# EAGLE design ROBOT (EAGLE 6.3)
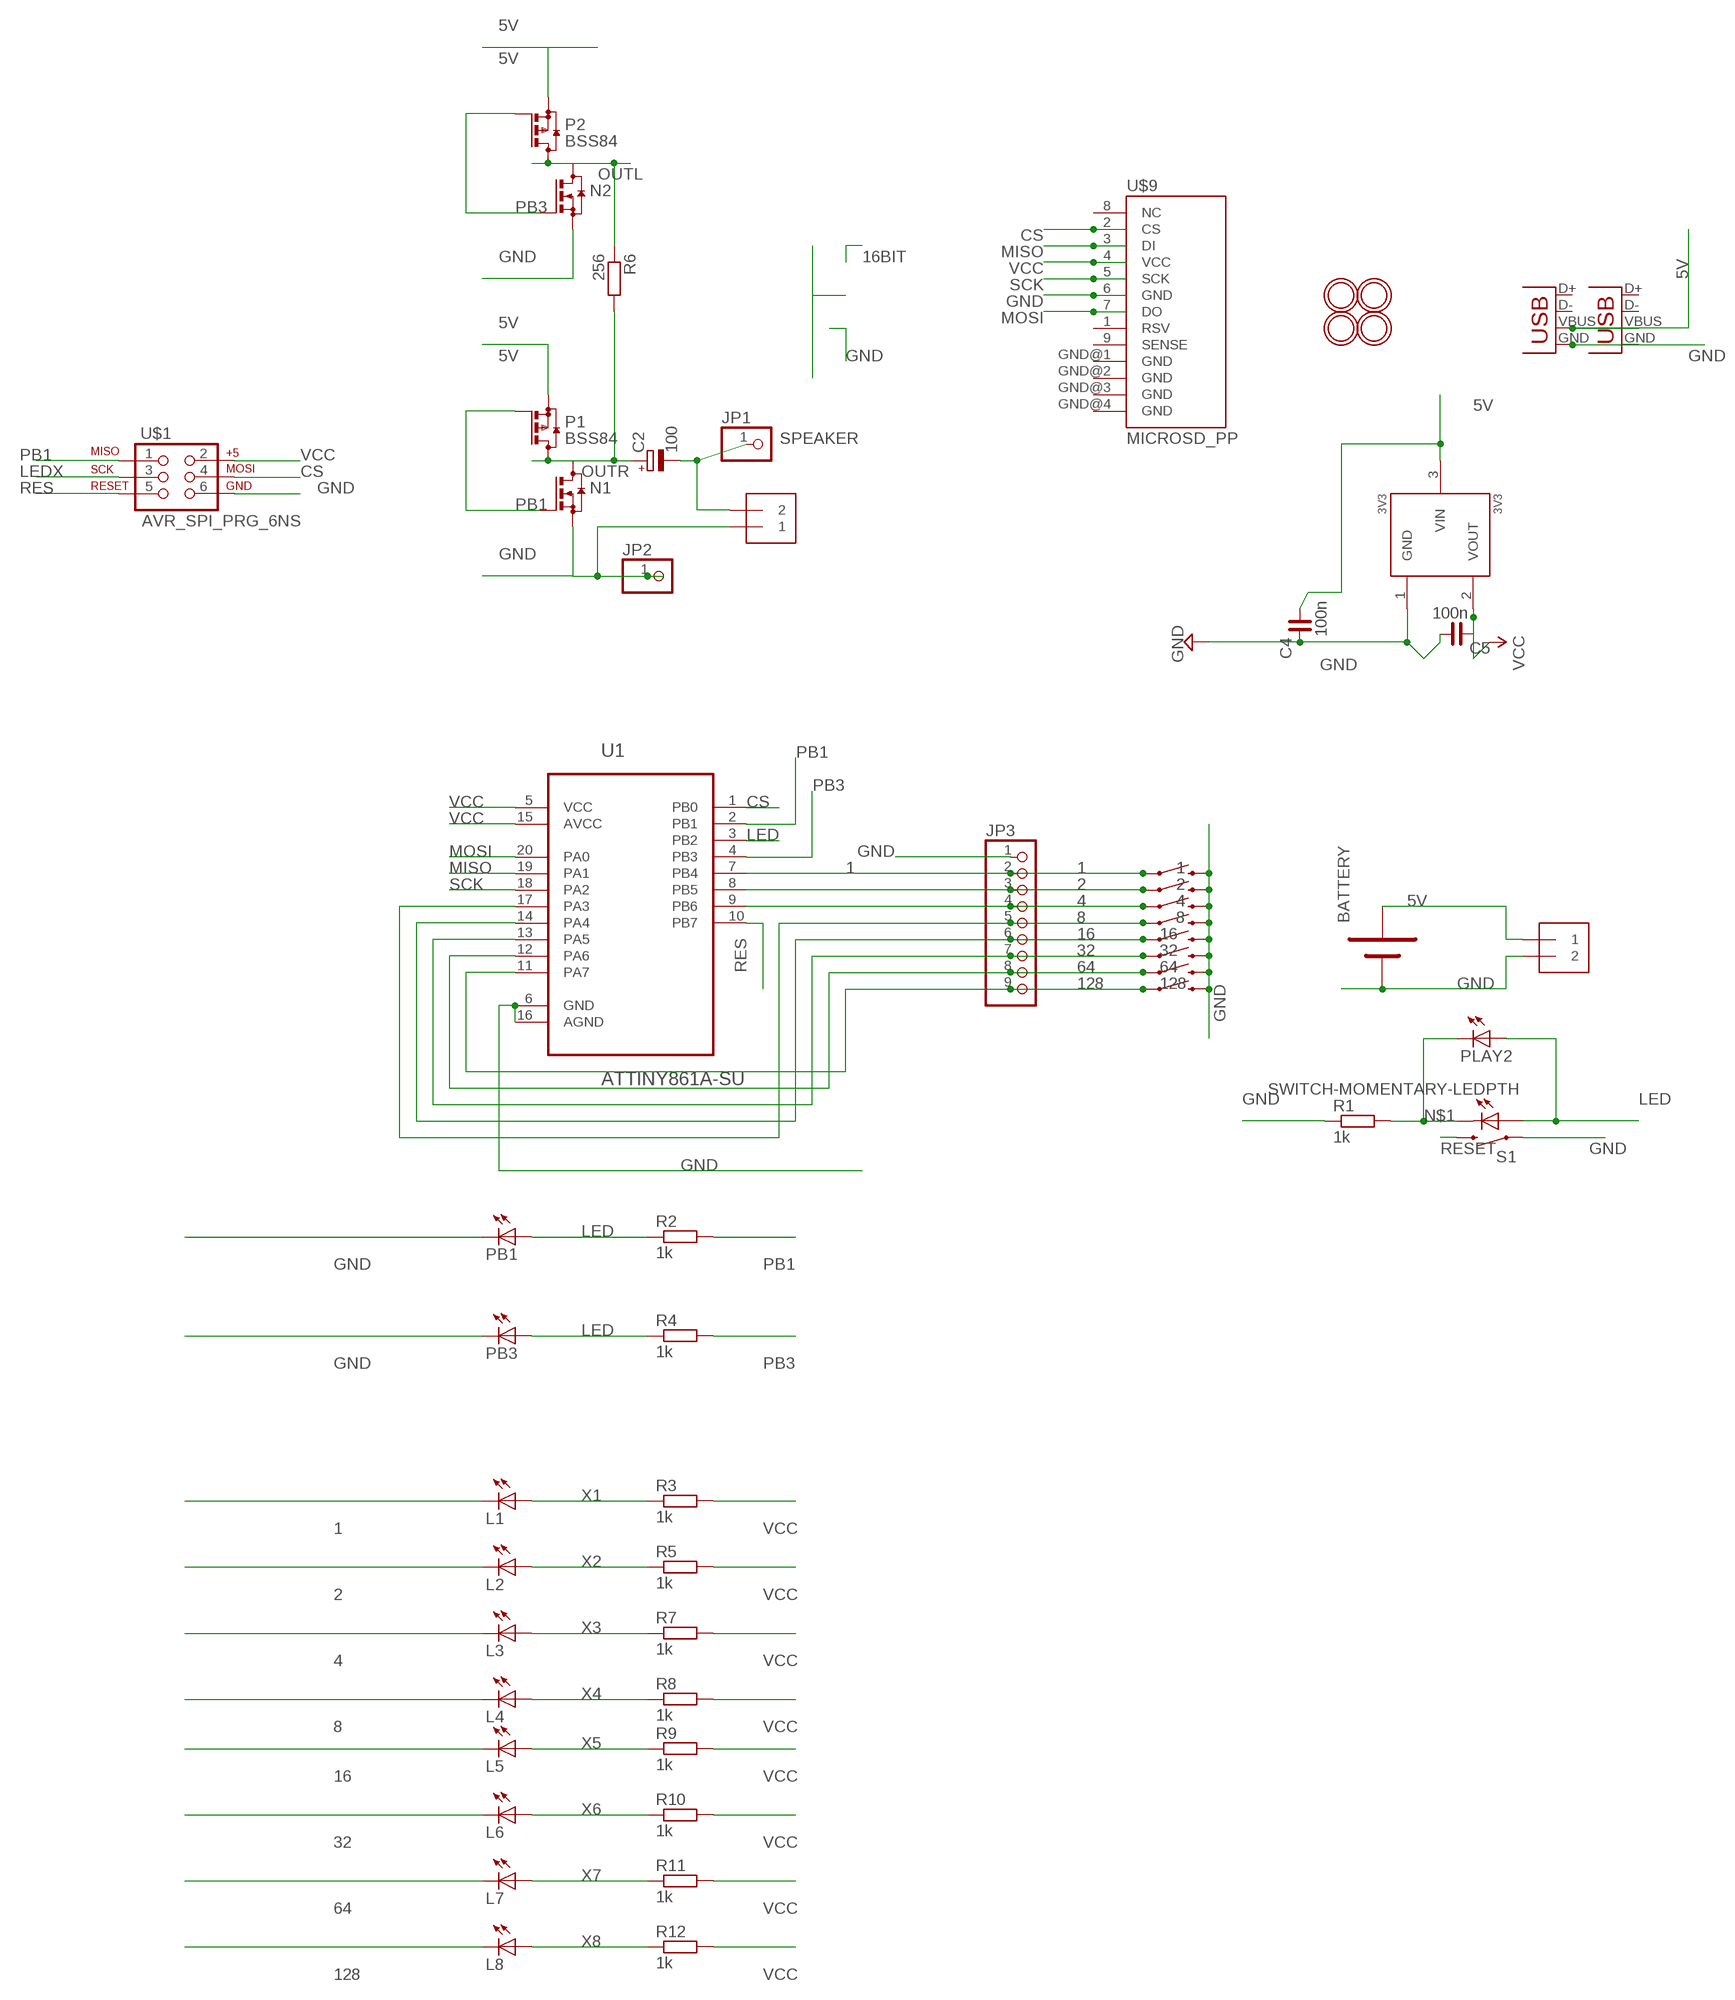
[diagram p0: schematic, sheet 1]

## Parts
1  SWITCH-MOMENTARY-2-SMD-1101NE  [TACTILE-SWITCH-1101NE]
2  SWITCH-MOMENTARY-2-SMD-1101NE  [TACTILE-SWITCH-1101NE]
3V3  3V3  MCP1700T  [SOT23]
4  SWITCH-MOMENTARY-2-SMD-1101NE  [TACTILE-SWITCH-1101NE]
8  SWITCH-MOMENTARY-2-SMD-1101NE  [TACTILE-SWITCH-1101NE]
16  SWITCH-MOMENTARY-2-SMD-1101NE  [TACTILE-SWITCH-1101NE]
32  SWITCH-MOMENTARY-2-SMD-1101NE  [TACTILE-SWITCH-1101NE]
64  SWITCH-MOMENTARY-2-SMD-1101NE  [TACTILE-SWITCH-1101NE]
128  SWITCH-MOMENTARY-2-SMD-1101NE  [TACTILE-SWITCH-1101NE]
BATTERY  BATTERY-1XAA20MM  [BATTCOM_20MM_PTH]
C2  100  CPOL-EU153CLV-0605  [153CLV-0605]
C4  100n  C_0603  [C0603]
C5  100n  C_0603  [C0603]
J1  1X2-3.5MM  [1X2-3.5MM]
J2  1X2-3.5MM  [1X2-3.5MM]
JP1  PINHD-1X1  [1X01]
JP2  PINHD-1X1  [1X01]
JP3  PINHD-1X9  [1X09]
L1  LEDSML0603  [SML0603]
L2  LEDSML0603  [SML0603]
L3  LEDSML0603  [SML0603]
L4  LEDSML0603  [SML0603]
L5  LEDSML0603  [SML0603]
L6  LEDSML0603  [SML0603]
L7  LEDSML0603  [SML0603]
L8  LEDSML0603  [SML0603]
N1  BSS123  [SOT23]
N2  BSS123  [SOT23]
P1  BSS84  [SOT23]
P2  BSS84  [SOT23]
PB1  LEDSML0603  [SML0603]
PB3  LEDSML0603  [SML0603]
PLAY2  LEDSML0603  [SML0603]
R1  1k  R-EU_R0603  [R0603]
R2  1k  R-EU_R0603  [R0603]
R3  1k  R-EU_R0603  [R0603]
R4  1k  R-EU_R0603  [R0603]
R5  1k  R-EU_R0603  [R0603]
R6  256  R-EU_R0603  [R0603]
R7  1k  R-EU_R0603  [R0603]
R8  1k  R-EU_R0603  [R0603]
R9  1k  R-EU_R0603  [R0603]
R10  1k  R-EU_R0603  [R0603]
R11  1k  R-EU_R0603  [R0603]
R12  1k  R-EU_R0603  [R0603]
S1  SWITCH-MOMENTARY-LEDPTH  [TACTILE-PTH-LED-12MM]
U1  ATTINY861A-SU  [SOIC127P1032X265-20N]
U$1  AVR_SPI_PRG_6NS  [2X3-NS]
U$3  MOUNTINGHOLE1.0  [MOUNTINGHOLE_1.0_PLATED]
U$4  MOUNTINGHOLE1.0  [MOUNTINGHOLE_1.0_PLATED]
U$6  MOUNTINGHOLE3.0THIN  [MOUNTINGHOLE_3.0_PLATEDTHIN]
U$7  MOUNTINGHOLE3.0THIN  [MOUNTINGHOLE_3.0_PLATEDTHIN]
U$9  MICROSD_PP  [MICROSD_PP]
X1  USB-MICROB  [USB-MICROB]
X5  USBSMD  [USB-MINIB]

## Nets
1: 1.P$1 JP3.2 L1.C U1.7(PB4)
2: 2.P$1 JP3.3 L2.C U1.8(PB5)
4: 4.P$1 JP3.4 L3.C U1.9(PB6)
5V [GND]: 3V3.3(VIN) BATTERY.+ C4.1 J2.1 P1.2(S) P2.2(S) X1.VBUS X5.VBUS
8: 8.P$1 JP3.5 L4.C U1.17(PA3)
16: 16.P$1 JP3.6 L5.C U1.14(PA4)
32: 32.P$1 JP3.7 L6.C U1.13(PA5)
64: 64.P$1 JP3.8 L7.C U1.12(PA6)
128: 128.P$1 JP3.9 L8.C U1.11(PA7)
CS: U1.1(PB0) U$1.4 U$9.2(CS)
GND: 1.P$2 2.P$2 3V3.1(GND) 4.P$2 8.P$2 16.P$2 32.P$2 64.P$2 128.P$2 BATTERY.- C4.2 C5.1 J1.1 J2.2 JP2.1 JP3.1 N1.2(S) N2.2(S) PB1.C PB3.C R1.1 S1.4 U1.6(GND) U1.16(AGND) U$1.6 U$9.6(GND) X1.GND X5.GND
LED: PB1.A PB3.A PLAY2.A R2.1 R4.1 S1.A U1.3(PB2)
LEDX: U$1.3
MISO: U1.19(PA1) U$9.3(DI)
MOSI: U1.20(PA0) U$9.7(DO)
N$1: PLAY2.C R1.2 S1.C
OUTL: N2.3(D) P2.3(D) R6.1
OUTR: C2.+ N1.3(D) P1.3(D) R6.2
PB1: N1.1(G) P1.1(G) R2.2 U1.2(PB1) U$1.1
PB3: N2.1(G) P2.1(G) R4.2 U1.4(PB3)
RES: U1.10(PB7) U$1.5
RESET: S1.2
SCK: U1.18(PA2) U$9.5(SCK)
SPEAKER: C2.- J1.2 JP1.1
VCC: 3V3.2(VOUT) C5.2 R3.2 R5.2 R7.2 R8.2 R9.2 R10.2 R11.2 R12.2 U1.5(VCC) U1.15(AVCC) U$1.2 U$9.4(VCC)
X1: L1.A R3.1
X2: L2.A R5.1
X3: L3.A R7.1
X4: L4.A R8.1
X5: L5.A R9.1
X6: L6.A R10.1
X7: L7.A R11.1
X8: L8.A R12.1
Unconnected: U$9.1(RSV) U$9.8(NC) U$9.9(SENSE) U$9.GND@1(GND) U$9.GND@2(GND) U$9.GND@3(GND) U$9.GND@4(GND) X1.D+ X1.D- X5.D+ X5.D-

## Library data of the parts
1 2 4 8 16 32 64 128 = SparkFun:SWITCH-MOMENTARY-2
3V3 = okie:MCP1700T
BATTERY = es:BATTERY-1XAA
C2 = resistor:CPOL-EU: POLARIZED CAPACITOR, European symbol
C4 C5 = rc-master-smd:C_: NON-POLARIZED CAP
J1 J2 = adafruit:1X2: 3.5mm Terminal block http://www.ladyada.net/library/pcb/eaglelibrary.html
JP1 JP2 = pinhead:PINHD-1X1: PIN HEADER
JP3 = pinhead:PINHD-1X9: PIN HEADER
L1-L8 PB1 PB3 PLAY2 = led:LED: LED OSRAM: - CHIPLED LG R971, LG N971, LY N971, LG Q971, LY Q971, LO R971, LY R971 LH N974, LH R974 LS Q976, LO Q976, LY Q976 LO Q996 - Hyper CHIPLED LW Q18S LB Q993, LB Q99A, LB R99A - SideLED LS A670, LO A670, LY A670, LG A670, LP A670 LB A673, LV A673, LT A673, LW A673 LH A674 LY A675 LS A676, LA A676, LO A676, LY A676, LW A676 LS A679, LY A679, LG A679 - Hyper Micro SIDELED® LS Y876, LA Y876, LO Y876, LY Y876 LT Y87S - SmartLED LW L88C, LW L88S LB L89C, LB L89S, LG L890 LS L89K, LO L89K, LY L89K LS L896, LA L896, LO L896, LY L896 - TOPLED LS T670, LO T670, LY T670, LG T670, LP T670 LSG T670, LSP T670, LSY T670, LOP T670, LYG T670 LG T671, LOG T671, LSG T671 LB T673, LV T673, LT T673, LW T673 LH T674 LS T676, LA T676, LO T676, LY T676, LB T676, LH T676, LSB T676, LW T676 LB T67C, LV T67C, LT T67C, LS T67K, LO T67K, LY T67K, LW E67C LS E67B, LA E67B, LO E67B, LY E67B, LB E67C, LV E67C, LT E67C LW T67C LS T679, LY T679, LG T679 LS T770, LO T770, LY T770, LG T770, LP T770 LB T773, LV T773, LT T773, LW T773 LH T774 LS E675, LA E675, LY E675, LS T675 LS T776, LA T776, LO T776, LY T776, LB T776 LHGB T686 LT T68C, LB T68C - Hyper Mini TOPLED® LB M676 - Mini TOPLED Santana® LG M470 LS M47K, LO M47K, LY M47K Source: http://www.osram.convergy.de LUXEON: - LUMILED® LXK2-PW12-R00, LXK2-PW12-S00, LXK2-PW14-U00, LXK2-PW14-V00 LXK2-PM12-R00, LXK2-PM12-S00, LXK2-PM14-U00 LXK2-PE12-Q00, LXK2-PE12-R00, LXK2-PE12-S00, LXK2-PE14-T00, LXK2-PE14-U00 LXK2-PB12-K00, LXK2-PB12-L00, LXK2-PB12-M00, LXK2-PB14-N00, LXK2-PB14-P00, LXK2-PB14-Q00 LXK2-PR12-L00, LXK2-PR12-M00, LXK2-PR14-Q00, LXK2-PR14-R00 LXK2-PD12-Q00, LXK2-PD12-R00, LXK2-PD12-S00 LXK2-PH12-R00, LXK2-PH12-S00 LXK2-PL12-P00, LXK2-PL12-Q00, LXK2-PL12-R00 Source: www.luxeon.com KINGBRIGHT: KA-3528ASYC Source: www.kingbright.com
N1 N2 = transistor-small-signal:BSS123: N-CHANNEL MOS FET
P1 P2 = transistor-small-signal:BSS84: P-CHANNEL MOS FET
R1-R12 = resistor:R-EU_: RESISTOR, European symbol
S1 = Local Library:SWITCH-MOMENTARY-LED
U1 = Atmel_By_element14_Batch_1-00:ATTINY861A-SU: 8-bit Microcontroller with In-System Programmable Flash; MPN: ATTINY861A-SU; OC_FARNELL: 1841628; OC_NEWARK: 12T1344; PACKAGE: SOIC-20; SUPPLIER: Atmel
U$1 = SparkFun:AVR_SPI_PRG_6: AVR ISP 6 Pin This is the reduced ISP connector for AVR programming. Common on Arduino. This footprint will take up less PCB space and can be used with a 10-pin to 6-pin adapter such as SKU: BOB-08508
U$3 U$4 U$6 U$7 = microbuilder:MOUNTINGHOLE: Mounting Hole
U$9 = DE1594-v2:MICROSD_PP
X1 X5 = SparkFun:USB: USB Connectors USB-B-PTH is fully proven SKU : PRT-00139 USB-miniB is fully proven SKU : PRT-00587 USB-A-PCB is untested. USB-A-H is throughly reviewed, but untested. Spark Fun Electronics SKU : PRT-00437 USB-B-SMT is throughly reviewed, but untested. Needs silkscreen touching up. USB-A-S has not been used/tested USB-MB-H has not been used/tested

## Net classes
0 default: width 0.279 mm, drill 0.381 mm, clearance 0.279 mm
1 GND: width 0.279 mm, drill 0.381 mm, clearance 0.279 mm
2 pwr: width 0.279 mm, drill 0.381 mm, clearance 0.279 mm

## Board
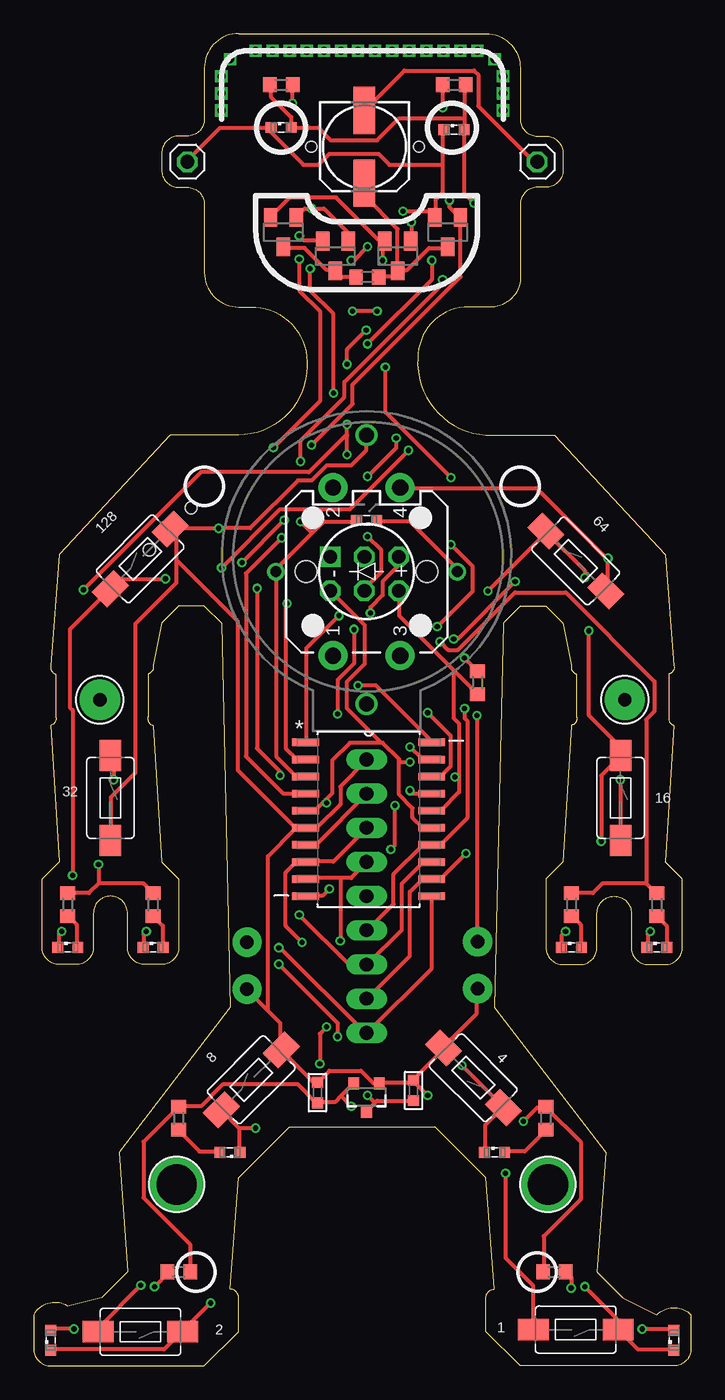
[diagram p1: board, top side]
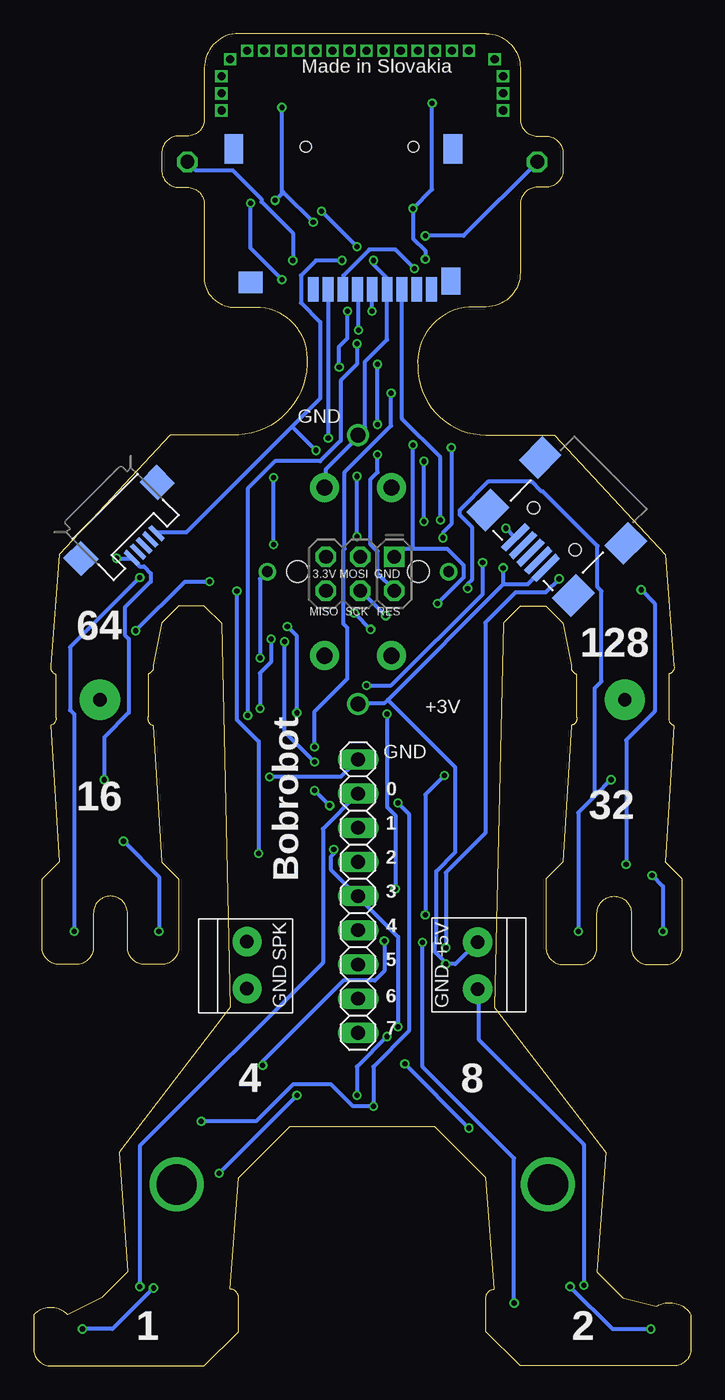
[diagram p2: board, bottom side, seen from below]

Size 48.89 x 99.06 mm. Coordinates in mm from the lower left corner, seen from the top.
Outline: 33.66,99.06 arc-90 36.2,96.52 36.2,92.71 arc90 37.46,91.44 38.1,91.44 arc-90 39.37,90.17 39.37,88.9 arc-90 38.1,87.63 37.46,87.63 arc90 36.2,86.36 36.2,81.28 arc-90 34.29,78.74 32.38,78.74 arc90 28.58,74.93 arc90 33.66,69.22 38.73,69.22 46.99,60.33 47.62,52.07 arc-90 47.24,51.44 47.24,48.26 arc90 47.62,47.62 46.99,37.47 48.26,36.2 48.26,31.11 arc-90 46.99,29.84 45.72,29.84 arc-90 44.45,31.11 44.45,33.66 arc90 43.18,34.92 arc90 41.91,33.66 41.91,31.11 arc-90 40.64,29.84 39.37,29.84 arc-90 38.1,31.11 38.1,36.2 39.37,37.47 40.01,47.62 arc90 40.39,48.26 40.39,51.44 arc-90 40.01,52.07 39.37,55.25 38.1,56.52 36.2,56.52 34.92,55.25 34.29,26.67 42.55,15.88 41.91,6.99 43.81,5.08 46.35,3.81 arc-90 48.89,3.81 48.89,1.27 arc-90 47.62,0 36.2,0 33.66,2.54 33.66,5.08 arc-90 34.29,5.71 33.66,13.97 29.84,17.78 19.05,17.78 15.24,13.97 14.61,5.71 arc-90 15.24,5.08 15.24,2.54 12.7,0 1.27,0 arc-90 0,1.27 0,3.81 arc-90 2.54,4.45 5.08,5.08 6.98,6.99 6.35,15.88 14.61,26.67 13.97,55.25 12.7,56.52 10.79,56.52 9.52,55.25 8.89,52.07 arc-90 8.51,51.44 8.51,48.26 arc90 8.89,47.62 9.52,37.47 10.79,36.2 10.79,31.11 arc-90 9.52,29.84 8.25,29.84 arc-90 6.98,31.11 6.98,33.66 arc90 5.71,34.92 arc90 4.45,33.66 4.45,31.11 arc-90 3.17,29.84 1.9,29.84 arc-90 0.63,31.11 0.63,36.2 1.9,37.47 1.27,47.62 arc90 1.65,48.26 1.65,51.44 arc-90 1.27,52.07 1.9,60.33 10.16,69.22 15.24,69.22 arc90 20.32,74.3 arc90 16.51,78.74 15.24,78.74 arc-90 12.7,81.28 12.7,86.36 arc90 11.43,87.63 10.79,87.63 arc-90 9.52,88.9 9.52,90.17 arc-90 10.79,91.44 11.43,91.44 arc90 12.7,92.71 12.7,96.52 arc-90 15.24,99.06 33.66,99.06
Copper layers (1*16): Top 0.035mm / dielectric 1.5mm / Bottom 0.035mm
Design rules "ITEADstudio_DRC *": minimum track width 6mil, minimum drill 12mil, track to track 6mil, track to pad 6mil, pad to pad 6mil, via to via 6mil, smd to smd 0mil, copper to edge 30mil, drill to drill 10mil, minimum pad ring 10mil, minimum via ring 6mil, stop-mask expansion 2mil, vias tented up to drill 100mil, thermal gap 10mil

### Footprints (pad centres in the part's own frame; a part is rotated, then mirrored left to right if it is on the bottom)
TACTILE-SWITCH-1101NE = smd 2.3 x 1.6: P$1 -3.15,0; P$2 3.15,0
SOT23 = smd 0.8 x 0.9: 1 -0.95,-1; 2 0.95,-1; 3 0,1.1
BATTCOM_20MM_PTH = drill 1.1: + 20,0; - 0,0
153CLV-0605 = smd 3.5 x 1.6: + 2.7,0; - -2.7,0
C0603 = smd 0.8 x 0.8: 1 -0.762,0; 2 0.762,0
1X2-3.5MM = drill 1 pad 2.184: 1 1.8,0; 2 -1.7,0
1X01 = drill 1.016 octagon: 1 0,0
1X09 = drill 1.016 long: 1 -10.16,0; 2 -7.62,0; 3 -5.08,0; 4 -2.54,0; 5 0,0; 6 2.54,0; 7 5.08,0; 8 7.62,0; 9 10.16,0
SML0603 = smd 0.8 x 0.8: A 0.75,0; C -0.75,0
SOT23' = smd 1 x 1.4: 1 -0.95,-1.1; 2 0.95,-1.1; 3 0,1.1
R0603 = smd 1 x 1.1: 1 -0.85,0; 2 0.85,0
TACTILE-PTH-LED-12MM = drill 1.2 pad 2.159: 1 -6.25,2.5; 2 6.25,2.5; 3 -6.25,-2.5; 4 6.25,-2.5 | drill 0.8: A 0,6.75; C 0,-6.75 | hole 1.6: 0,4.5; 0,-4.5
SOIC127P1032X265-20N = smd 1.981 x 0.559: 1 -4.699,5.715; 2 -4.699,4.445; 3 -4.699,3.175; 4 -4.699,1.905; 5 -4.699,0.635; 6 -4.699,-0.635; 7 -4.699,-1.905; 8 -4.699,-3.175; 9 -4.699,-4.445; 10 -4.699,-5.715; 11 4.699,-5.715; 12 4.699,-4.445; 13 4.699,-3.175; 14 4.699,-1.905; 15 4.699,-0.635; 16 4.699,0.635; 17 4.699,1.905; 18 4.699,3.175; 19 4.699,4.445; 20 4.699,5.715
2X3-NS = drill 1.016 square: 1 -2.54,-1.27 | drill 1.016 octagon: 2 -2.54,1.27; 3 0,-1.27; 4 0,1.27; 5 2.54,-1.27; 6 2.54,1.27
MOUNTINGHOLE_1.0_PLATED = drill 1 pad 3: P$1 0,0
MOUNTINGHOLE_3.0_PLATEDTHIN = drill 3 pad 3.6: P$1 0,0
MICROSD_PP = smd 1.8 x 0.8: 1 0,3.85; 2 0,2.75; 3 0,1.65; 4 0,0.55; 5 0,-0.55; 6 0,-1.65; 7 0,-2.75; 8 0,-3.85; 9 0,-4.95 | smd 1.6 x 1.8: GND@1 0.5,8.5 | smd 2.2 x 1.4: GND@2 10.45,9.75; GND@4 10.45,-6.55 | smd 2 x 1.4: GND@3 0.6,-6.4 | hole 0.8: 10.6,4.4; 10.6,-3.6
USB-MICROB = smd 0.35 x 1.4: D+ 0,2.65; D- -0.65,2.65; GND 1.3,2.65; ID 0.65,2.65; VBUS -1.3,2.65 | smd 1.8 x 1.9: MT1 -4,0; MT2 4,0
USB-MINIB = smd 2.5 x 0.5: D+ 2.5,0; D- 2.5,0.8; GND 2.5,-1.6; ID 2.5,-0.8; VBUS 2.5,1.6 | smd 2.5 x 2: MTN1 -3,4.5; MTN2 2.5,4.5; MTN3 -3,-4.5; MTN4 2.5,-4.5 | hole 0.9: 0,2.2; 0,-2.2

### Placement (x,y rotation side)
1  40.32,2.7 180 top
2  7.94,2.54 180 top
3V3  24.77,20 180 top
4  32.7,21.43 135 top
8  16.19,21.27 45 top
16  43.66,42.23 270 top
32  5.71,42.23 270 top
64  40.32,59.85 315 top
128  7.94,60.01 45 top
BATTERY  24.77,69.22 270 top
C2  24.61,90.65 270 top
C4  28.26,20.48 90 top
C5  21.11,20.32 270 top
J1  33.02,29.84 270 bottom
J2  15.88,29.72 90 bottom
JP1  37.46,89.53 0 top
JP2  11.43,89.53 0 top
JP3  24.77,34.92 270 bottom
L1  47.62,1.9 90 top
L2  1.27,1.9 90 top
L3  34.29,15.88 0 top
L4  14.61,15.88 180 top
L5  40.01,31.11 0 top
L6  8.89,31.11 0 top
L7  46.35,31.11 0 top
L8  2.54,31.11 0 top
N1  BSS123  [SOT23']  30.8,84.3 180 top
N2  BSS123  [SOT23']  22.45,82.52 180 top
P1  BSS84  [SOT23']  27.08,82.52 180 top
P2  BSS84  [SOT23']  18.57,84.3 180 top
PB1  31.27,91.92 0 top
PB3  18.41,92.08 0 top
PLAY2  24.77,62.86 180 top
R1  33.02,50.8 90 top
R2  31.27,95.25 180 top
R3  38.73,6.99 180 top
R4  18.41,95.25 0 top
R5  10.79,6.99 0 top
R6  24.83,80.96 0 top
R7  38.1,18.41 90 top
R8  10.79,18.41 90 top
R9  40.01,34.29 90 top
R10  8.89,34.29 90 top
R11  46.35,34.29 90 top
R12  2.54,34.29 90 top
S1  24.77,59.06 90 top
U1  24.92,40.64 0 top
U$1  24.61,58.9 180 bottom
U$3  43.97,49.53 0 top
U$4  4.92,49.53 0 top
U$6  10.64,13.49 0 top
U$7  38.26,13.49 0 top
U$9  24.25,80.05 90 bottom
X1  42.55,62.86 225 bottom
X5  10.16,62.23 225 bottom

### Tracks (layer width: path | path; a pad name or v marks a point on that pad's centre or on a via)
1  (via drill 0.38)
  Top 0.279: L1.C 47.6,1.22 44.96,1.22 43.54,2.64 1.P$1 43.33,2.74 43.33,3.56 v41,5.89 | U1.7 20.27,38.81 21.08,38.81 24.74,42.47 JP3.2
  Bottom 0.279: v41,5.89 41,16.36 27.38,29.97 27.38,39.93 JP3.2
2  (via drill 0.38)
  Top 0.279: JP3.3 24.74,39.93 22.3,37.49 20.27,37.49 U1.8 20.17,37.39 19.46,37.39 18.75,36.68 18.75,32.72 v19.96,31.5 | L2.C 1.27,1.22 9.7,1.22 11.02,2.54 2.P$1 11.12,2.64 v13.16,4.67
  Bottom 0.279: v19.96,31.5 19.96,22.25 13.16,15.44 v13.16,4.67
4  (via drill 0.38)
  Top 0.279: L3.C 33.58,15.95 33.58,17.88 34.9,19.2 4.P$1 34.9,19.3 v31.85,22.35 | 22.81,36.27 23.62,36.27 24.74,37.39 JP3.4 | 22.81,36.27 20.27,36.27 U1.9 | 22.81,36.27 v22.81,31.6
  Bottom 0.279: v31.85,22.35 31.85,22.66 25.86,28.65 23.52,28.65 22.81,29.36 v22.81,31.6
5V  (via drill 0.38)
  Top 0.279: P2.2 17.63,85.45 19.05,86.87 22.5,86.87 25.65,83.72 26.06,83.72 P1.2 25.96,83.62 v25.96,82.19 | 25.4,19.56 24.84,19 3V3.3 | 25.4,19.56 25.55,19.71 28.19,19.71 C4.1 | v24.84,20.12 25.4,19.56 | v22.61,24.49 22.61,25.5 v18.24,29.87 | v27.89,68.07 23.52,63.7 18.34,63.7 v13.97,59.33
  Bottom 0.279: 29.67,69.85 27.58,71.93 27.58,77.62 29.01,79.05 29.01,81.08 27.89,82.19 v25.96,82.19 | 29.67,69.85 37.54,61.98 39.67,61.98 X1.VBUS | 13.97,58.11 12.14,58.11 11.02,59.23 10.82,59.23 X5.VBUS | 22.55,49.53 22.81,49.28 24.74,49.28 BATTERY.+ | 22.55,49.53 13.97,58.11 | v24.84,20.12 24.84,22.25 v22.61,24.49 | J2.1 15.9,31.5 17.53,29.87 v18.24,29.87 18.24,29.97 19.05,30.79 19.05,31.39 18.95,31.5 18.95,36.78 17.53,38.2 17.53,44.5 22.55,49.53 | v27.89,68.07 29.67,69.85 | 13.97,58.11 v13.97,59.33
8  (via drill 0.38)
  Top 0.279: 15.29,17.68 15.29,15.95 L4.C | 15.29,17.68 13.97,19 8.P$1 | v27.99,42.77 28.19,42.57 29.62,42.57 U1.17 | v26.87,41.66 26.87,38.71 v26.57,38.41 | v16.51,17.68 15.29,17.68 | v21.29,22.45 21.29,24.69 v21.79,25.2
  Bottom 0.279: v26.87,41.66 v27.99,42.77 | v26.57,38.41 26.57,38.1 26.77,37.9 26.77,36.88 24.84,34.95 JP3.5 24.74,34.85 21.79,31.9 v21.79,25.2 | v21.29,22.45 v16.51,17.68
16  (via drill 0.38)
  Top 0.279: JP3.6 24.84,32.41 26.77,34.34 26.77,36.58 28.91,38.71 29.62,38.71 U1.14 29.72,38.81 30.33,38.81 32.26,40.74 32.26,47.95 32.05,48.16 v32.05,48.87 | v39.57,32.31 39.27,32 39.27,31.19 L5.C | v42.21,39.01 42.21,43.89 43.64,45.31 16.P$1 43.64,45.52 43.64,46.03 41.3,48.36 v41.3,54.66 | v31.24,54.05 31.55,54.05 v35.81,58.32
  Bottom 0.279: v39.57,32.31 39.57,36.37 v42.21,39.01 | v32.05,48.87 32.05,51.51 31.24,52.32 v31.24,54.05 | v35.81,58.32 37.64,58.32 v41.3,54.66
32  (via drill 0.38)
  Top 0.279: U1.13 29.62,37.39 28.91,37.39 27.38,35.86 27.38,32.41 24.84,29.87 JP3.7 24.64,29.87 23.42,29.87 v19.76,33.53 | v8.38,32.31 8.18,32.11 8.18,31.19 L6.C | v5.94,43.59 5.94,45.11 5.74,45.31 32.P$1 | v18.34,43.89 18.34,44.2 16.61,45.92 v16.61,57.81
  Bottom 0.279: v8.38,32.31 8.38,41.15 7.11,42.42 | v5.94,43.59 7.11,42.42 | v19.76,33.53 19.76,42.47 v18.34,43.89 | v16.61,57.81 16.61,58.11 16.31,58.42 16.31,62.38 17.22,63.3 17.22,63.6 15.09,65.73 11.84,65.73 11.12,65.02 11.02,65.02 6.96,60.96 6.96,57.91 6.65,57.61 6.65,50.9 7.16,50.39 7.16,42.47 7.11,42.42
64  (via drill 0.38)
  Top 0.279: JP3.8 24.84,27.33 27.99,30.48 27.99,35.25 28.91,36.17 29.62,36.17 U1.12 29.72,36.27 30.33,36.27 v32.16,38.1 | v45.87,32.31 45.67,32.11 45.67,31.19 L7.C | v41,58.62 41,59.13 38.15,61.98 64.P$1 38.05,61.87 v33.78,57.61
  Bottom 0.279: v45.87,32.31 45.87,48.46 46.18,48.77 46.18,53.44 v41,58.62 | v32.16,38.1 32.16,46.43 33.78,48.06 v33.78,57.61
128  (via drill 0.38)
  Top 0.279: U1.11 29.62,34.85 29.62,29.57 24.84,24.79 JP3.9 24.64,24.79 18.34,31.09 v18.24,31.09 | v2.08,32.31 1.88,32.11 1.88,31.19 L8.C | v2.9,36.47 2.9,48.77 2.69,48.97 2.69,54.76 128.P$1 5.84,57.81 6.55,58.52 v9.8,58.52
  Bottom 0.279: v2.08,32.31 2.08,35.66 v2.9,36.47 | v18.24,31.09 18.24,36.68 15.29,39.62 15.29,55.27 13.06,57.51 10.82,57.51 v9.8,58.52
CS  (via drill 0.38)
  Top 0.279: v26.98,68.99 26.98,68.28 v24.84,66.14 | v24.84,61.67 25.86,60.66 25.86,59.03 24.54,57.71 U$1.4 | v22.71,55.78 20.27,53.34 20.27,46.43 U1.1
  Bottom 0.279: v26.98,68.99 26.98,79.96 U$9.2 | v24.84,61.67 v24.84,66.14 | v22.71,55.78 24.54,57.61 U$1.4
GND  (via drill 0.38)
  Top 0.279: C4.2 28.3,21.34 30.53,23.57 4.P$2 30.53,23.77 32.97,26.21 32.97,28.04 J1.1 | C4.2 28.19,21.13 28.09,21.03 25.76,21.03 3V3.1 25.65,21.03 25.25,21.03 24.33,21.95 22,21.95 21.18,21.13 C5.1 21.08,21.13 20.78,21.13 18.44,23.47 8.P$2 18.34,23.57 18.34,25.5 17.37,26.47 | v35.1,14.33 35.1,8.03 37.13,5.99 37.13,2.74 1.P$2 | v29.31,20.12 28.3,21.13 C4.2 | 31.29,51.66 27.18,55.78 27.18,57.61 U$1.6 | 31.29,51.66 32.97,49.99 R1.1 | 31.65,43.79 31.65,47.75 31.24,48.16 31.24,51.61 31.29,51.66 | 31.65,43.79 31.65,42.67 30.33,41.35 29.72,41.35 U1.16 | U1.6 20.27,40.03 21.08,40.03 22.81,41.76 22.81,43.08 24.74,45.01 JP3.1 | v7.98,5.99 4.83,2.84 4.83,2.54 2.P$2 | 17.37,26.47 15.9,27.94 J2.2 | U1.6 20.17,39.93 19.46,39.93 17.42,37.9 17.42,26.52 17.37,26.47 | v31.34,43.79 31.65,43.79 | 10.62,59.84 10.62,61.77 10.21,62.18 128.P$2 10.21,62.28 v13.77,62.28 16.1,62.28 19.66,65.84 20.68,65.84 21.79,66.95 23.62,66.95 24.74,68.07 24.74,69.19 BATTERY.- | 10.62,59.84 10.62,58.22 7.57,55.17 7.57,44.09 5.74,42.27 5.74,39.12 32.P$2 | 30.43,89.31 30.43,87.27 29.92,86.77 29.92,85.45 N1.2 29.82,85.85 v27.48,85.85 | 30.43,89.31 30.43,91.85 PB1.C | JP2.1 11.43,89.61 13.87,92.05 17.63,92.05 PB3.C 17.42,91.95 20.07,89.31 21.18,89.31 22,90.12 25.65,90.12 26.47,89.31 30.43,89.31 | v19.76,84.02 20.07,83.72 21.49,83.72 N2.2 | 64.P$2 42.62,57.71 42.72,57.81 v42.72,60.05 42.62,60.05 37.44,65.23 27.28,65.23 S1.4 | v43.64,43.59 43.64,39.12 16.P$2 | v24.84,83.21 23.83,82.19 v23.62,82.19 | U1.6 19.46,40.03 15.19,44.3 15.19,55.37 10.72,59.84 10.62,59.84
  Bottom 0.279: v29.31,20.12 v35.1,14.33 | v7.98,5.99 7.98,16.46 15.8,24.28 15.8,27.94 J2.2 | v31.34,43.79 26.06,43.79 JP3.1 | v13.77,62.28 13.16,61.67 X5.GND | v19.76,84.02 16.92,84.02 11.43,89.51 JP2.1 | S1.4 27.18,65.33 27.18,66.65 24.74,69.09 BATTERY.- 24.74,69.29 24.23,69.8 24.23,74.68 22.61,76.3 22.61,79.96 U$9.6 22.61,80.16 22.61,80.87 23.62,81.89 v23.62,82.19 | v42.72,60.05 41.6,60.05 X1.GND 41.5,59.94 41,59.44 40.69,59.44 40.18,58.93 40.18,58.32 42.11,56.39 42.11,54.36 41.81,54.05 41.81,48.56 43.64,46.74 v43.64,43.59 | v24.84,83.21 v27.48,85.85
LED  (via drill 0.38)
  Top 0.279: 32.05,92.76 32.05,95.2 R2.1 | 32.05,92.76 32.05,91.95 PB1.A 32.05,91.85 32.05,87.17 v32.77,86.46 | R4.1 17.63,95.2 17.63,94.39 19.15,92.86 19.15,92.15 PB3.A 19.25,92.05 21.18,92.05 22.1,91.13 25.55,91.13 27.18,92.76 32.05,92.76 | 20.73,61.92 17.93,59.13 S1.A 18.03,58.93 18.03,45.31 19.46,43.89 20.17,43.89 U1.3 | 20.73,61.92 21.59,62.79 23.93,62.79 PLAY2.A | v30.43,80.77 30.43,80.47 23.11,73.15 23.11,72.03 19.86,68.78 v19.86,67.26 | 20.73,61.92 v19.86,62.79
  Bottom 0.279: v32.77,86.46 32.77,83.11 v30.43,80.77 | v19.86,62.79 v19.86,67.26
MISO  (via drill 0.38)
  Top 0.279: v20.57,81.58 20.57,79.96 22.3,78.23 v22.3,72.34 | v27.99,46.03 28.91,45.11 29.62,45.11 U1.19
  Bottom 0.279: v20.57,81.58 22,83.01 23.93,83.01 25.86,81.08 25.86,80.06 U$9.3 | v22.3,72.34 22.3,69.9 25.76,66.45 25.76,60.76 25.86,60.66 25.86,55.17 25.55,54.86 25.55,51.11 27.99,48.67 v27.99,46.03
MOSI  (via drill 0.38)
  Top 0.279: v15.49,59.74 v18.64,62.89 | v24.13,50.6 25.45,50.6 29.62,46.43 U1.20
  Bottom 0.279: v18.64,62.89 18.64,67.56 21.49,70.41 21.49,79.96 U$9.7 | v15.49,59.74 15.49,57.4 22.3,50.6 v24.13,50.6
N$1  (via drill 0.38)
  Top 0.279: PLAY2.C 25.55,62.79 27.99,62.79 31.45,59.33 31.45,59.13 S1.C | v32.05,52.63 32.97,51.71 R1.2
  Bottom 0.279: v32.05,52.63 32.05,58.52 31.55,59.03 S1.C
N$2  (via drill 0.6)
  other vias: 16.51,97.79
N$3  (via drill 0.6)
  other vias: 17.78,97.79
N$4  (via drill 0.6)
  other vias: 19.05,97.79
N$5  (via drill 0.6)
  other vias: 20.32,97.79
N$6  (via drill 0.6)
  other vias: 21.59,97.79
N$7  (via drill 0.6)
  other vias: 22.86,97.79
N$8  (via drill 0.6)
  other vias: 24.13,97.79
N$9  (via drill 0.6)
  other vias: 25.4,97.79
N$10  (via drill 0.6)
  other vias: 26.67,97.79
N$11  (via drill 0.6)
  other vias: 27.94,97.79
N$19  (via drill 0.6)
  other vias: 29.21,97.79
N$20  (via drill 0.6)
  other vias: 30.48,97.79
N$21  (via drill 0.6)
  other vias: 31.75,97.79
N$22  (via drill 0.6)
  other vias: 33.02,97.79
N$23  (via drill 0.6)
  other vias: 34.29,97.16
N$24  (via drill 0.6)
  other vias: 34.92,95.88
N$25  (via drill 0.6)
  other vias: 34.92,94.61
N$26  (via drill 0.6)
  other vias: 34.92,93.34
N$27  (via drill 0.6)
  other vias: 14.61,97.16
N$28  (via drill 0.6)
  other vias: 13.97,95.88
N$29  (via drill 0.6)
  other vias: 13.97,94.61
N$30  (via drill 0.6)
  other vias: 13.97,93.34
OUTL
  Top 0.279: R6.1 23.93,80.97 22.91,80.97 22.5,81.38 N2.3 22.4,81.48 21.79,81.48 20.17,83.11 18.64,83.11 P2.3
OUTR
  Top 0.279: R6.2 25.76,80.97 26.67,80.97 27.08,81.38 P1.3 | N1.3 30.73,83.11 29.41,83.11 27.79,81.48 27.18,81.48 P1.3 | C2.+ 24.64,87.88 24.64,86.97 27.08,84.53 27.08,81.48 P1.3
PB1  (via drill 0.38)
  Top 0.279: v30.43,93.57 30.43,95.2 R2.2 | v30.94,86.66 30.94,86.16 31.65,85.45 N1.1 31.75,85.34 31.75,80.97 23.72,72.95 23.72,71.53 v20.68,68.48 | v28.09,85.04 28.09,83.72 P1.1 | v18.85,56.69 18.75,56.59 18.75,45.92 19.56,45.11 20.17,45.11 U1.2
  Bottom 0.279: 30.43,87.27 30.43,87.17 v30.94,86.66 | 30.43,87.27 v30.43,93.57 | v28.09,85.04 30.33,87.27 30.43,87.27 | v18.85,56.69 16.92,58.62 16.92,59.54 18.14,60.76 20.68,60.76 | 20.68,60.76 21.49,60.76 22,60.25 U$1.1 | 20.68,60.76 v20.68,68.48
PB3  (via drill 0.38)
  Top 0.279: v19.25,93.88 19.25,95.2 R4.2 | P2.1 19.56,85.45 20.17,86.05 v20.68,86.05 21.59,86.05 23.32,84.33 23.32,83.72 N2.1 | v18.44,61.57 15.8,58.93 15.8,45.31 18.54,42.57 20.17,42.57 U1.4 | v17.83,68.28 21.29,71.73 21.29,78.44 19.76,79.96 v19.76,82.3
  Bottom 0.279: v19.25,93.88 19.25,87.48 v20.68,86.05 20.68,83.82 19.76,82.91 v19.76,82.3 | v18.44,61.57 18.44,61.98 17.83,62.59 v17.83,68.28
RES  (via drill 0.38)
  Top 0.279: v22,35.46 21.49,34.95 20.27,34.95 U1.10 | v22.61,48.46 22.61,51 23.83,52.22 v23.83,54.76 | v25.04,55.98 25.04,56.39 25.96,57.3 25.96,58.32 27.08,59.44 27.08,60.15 U$1.5
  Bottom 0.279: v22,35.46 22,40.95 22.61,41.55 v22.61,48.46 | v25.04,55.98 v23.83,54.76
SCK  (via drill 0.38)
  Top 0.279: v25.55,78.44 v23.72,78.44 | v26.16,74.27 26.16,70.92 v31.04,66.04 | v31.04,61.06 32.66,59.44 32.66,57.61 v30.02,54.97 | v29.31,48.56 31.04,46.84 31.04,44.6 30.33,43.89 29.72,43.89 U1.18
  Bottom 0.279: v23.72,78.44 23.72,79.96 U$9.5 | v25.55,78.44 25.55,76.4 26.16,75.79 v26.16,74.27 | v31.04,61.06 v31.04,66.04 | v30.02,54.97 29.31,54.25 v29.31,48.56
SPEAKER  (via drill 0.38)
  Top 0.279: JP1.1 37.44,89.61 37.13,89.61 33.07,93.67 33.07,96.01 32.77,96.32 27.58,96.32 24.64,93.37 C2.- | v32.97,48.36 32.97,31.6 J1.2 | v24.84,76 29.62,80.77 v29.62,82.19
  Bottom 0.279: v32.97,48.36 32.97,65.23 30.94,67.26 27.58,67.26 26.06,68.78 26.06,73.25 24.84,74.47 v24.84,76 | v29.62,82.19 29.62,84.23 31.95,86.56 31.95,86.77 34.09,88.9 36.83,88.9 JP1.1
VCC  (via drill 0.38)
  Top 0.279: 4.83,35.86 4.12,35.15 2.59,35.15 R12.2 | 4.83,35.86 8.18,35.86 8.89,35.15 R10.2 | v24.74,77.01 23.32,75.59 v23.32,74.47 | v23.32,67.77 23.32,69.19 | 23.32,69.19 v23.32,70 | v4.83,37.29 4.83,35.86 | v3.71,57.71 12.45,66.45 20.47,66.45 23.22,69.19 23.32,69.19 | R3.2 37.95,7.01 37.95,9.65 40.69,12.39 40.69,16.66 38.15,19.2 R7.2 38.05,19.2 37.44,19.2 v36.42,18.19 | 22.86,20.07 23.72,20.93 3V3.2 | 22.86,20.07 22.4,19.61 21.18,19.61 C5.2 20.98,19.61 19.66,20.93 14.07,20.93 12.45,19.3 10.82,19.3 R8.2 10.72,19.2 8.18,16.66 8.18,12.5 11.63,9.04 11.63,7.01 R5.2 | 22.86,20.07 v23.62,19.3 | 45.57,35.86 42.32,35.86 41.6,35.15 40.08,35.15 R9.2 | 45.57,35.86 46.28,35.15 R11.2 | 21.64,42.01 22.2,42.57 22.2,45.01 23.52,46.33 25.76,46.33 | 21.64,42.01 20.98,41.35 20.27,41.35 U1.5 | 25.76,46.33 25.96,46.33 27.18,45.11 27.18,44.91 | 27.18,44.91 27.18,42.47 28.19,41.45 28.19,40.74 28.91,40.03 29.62,40.03 U1.15 | 45.57,35.86 45.57,48.06 46.18,48.67 46.18,50.9 39.57,57.51 35.81,57.51 31.55,53.24 30.84,53.24 v30.23,53.85 | 27.18,44.91 v27.99,44.91 | 21.64,42.01 v21.79,41.86 | U$1.2 22.1,57.61 24.64,55.07 24.64,52.22 23.32,50.9 23.32,48.87 25.76,46.43 25.76,46.33
  Bottom 0.279: v24.74,77.01 24.74,79.96 U$9.4 | v23.32,70 v23.32,74.47 | v23.32,67.77 23.32,66.45 23.83,65.94 23.83,61.06 23.32,60.55 23.32,58.93 22.1,57.71 U$1.2 | v4.83,37.29 4.83,46.53 2.69,48.67 2.69,56.69 v3.71,57.71 | v36.42,18.19 32.36,18.19 29.62,20.93 26.77,20.93 25.15,19.3 v23.62,19.3 23.62,22.25 20.98,24.89 20.98,41.05 v21.79,41.86 | v30.23,53.85 30.23,47.14 v27.99,44.91
X1  (via drill 0.38)
  Top 0.279: v45.26,2.74 47.6,2.74 L1.A | v39.98,5.79 39.98,6.6 39.67,6.91 R3.1
  Bottom 0.279: v45.26,2.74 43.03,2.74 v39.98,5.79
X2  (via drill 0.38)
  Top 0.279: v3,2.74 1.27,2.74 L2.A | v8.99,5.89 10.01,6.91 R5.1
  Bottom 0.279: v3,2.74 5.84,2.74 v8.99,5.89
X3
  Top 0.279: L3.A 35.1,15.95 36.52,15.95 38.05,17.48 R7.1
X4
  Top 0.279: L4.A 13.77,15.95 12.34,15.95 10.82,17.48 R8.1
X5
  Top 0.279: L5.A 40.69,31.19 40.69,32.82 40.08,33.43 R9.1
X6
  Top 0.279: L6.A 9.6,31.19 9.6,32.72 8.89,33.43 R10.1
X7
  Top 0.279: L7.A 47.09,31.19 47.09,32.72 46.38,33.43 R11.1
X8
  Top 0.279: L8.A 3.2,31.19 3.2,32.82 2.59,33.43 R12.1

### Text on the board
bNames: Made in Slovakia | GND | GND | MOSI | 3.3V | RES | SCK | MISO | 64 | 128 | +3V | Bobrobot | GND | 0 | 1 | 16 | 32 | 2 | 3 | +5V | 4 | SPK | 5 | GND | GND | 6 | 7 | 8 | 4 | 2 | 1